# EAGLE design at91sam7x-ek (EAGLE 4.16)
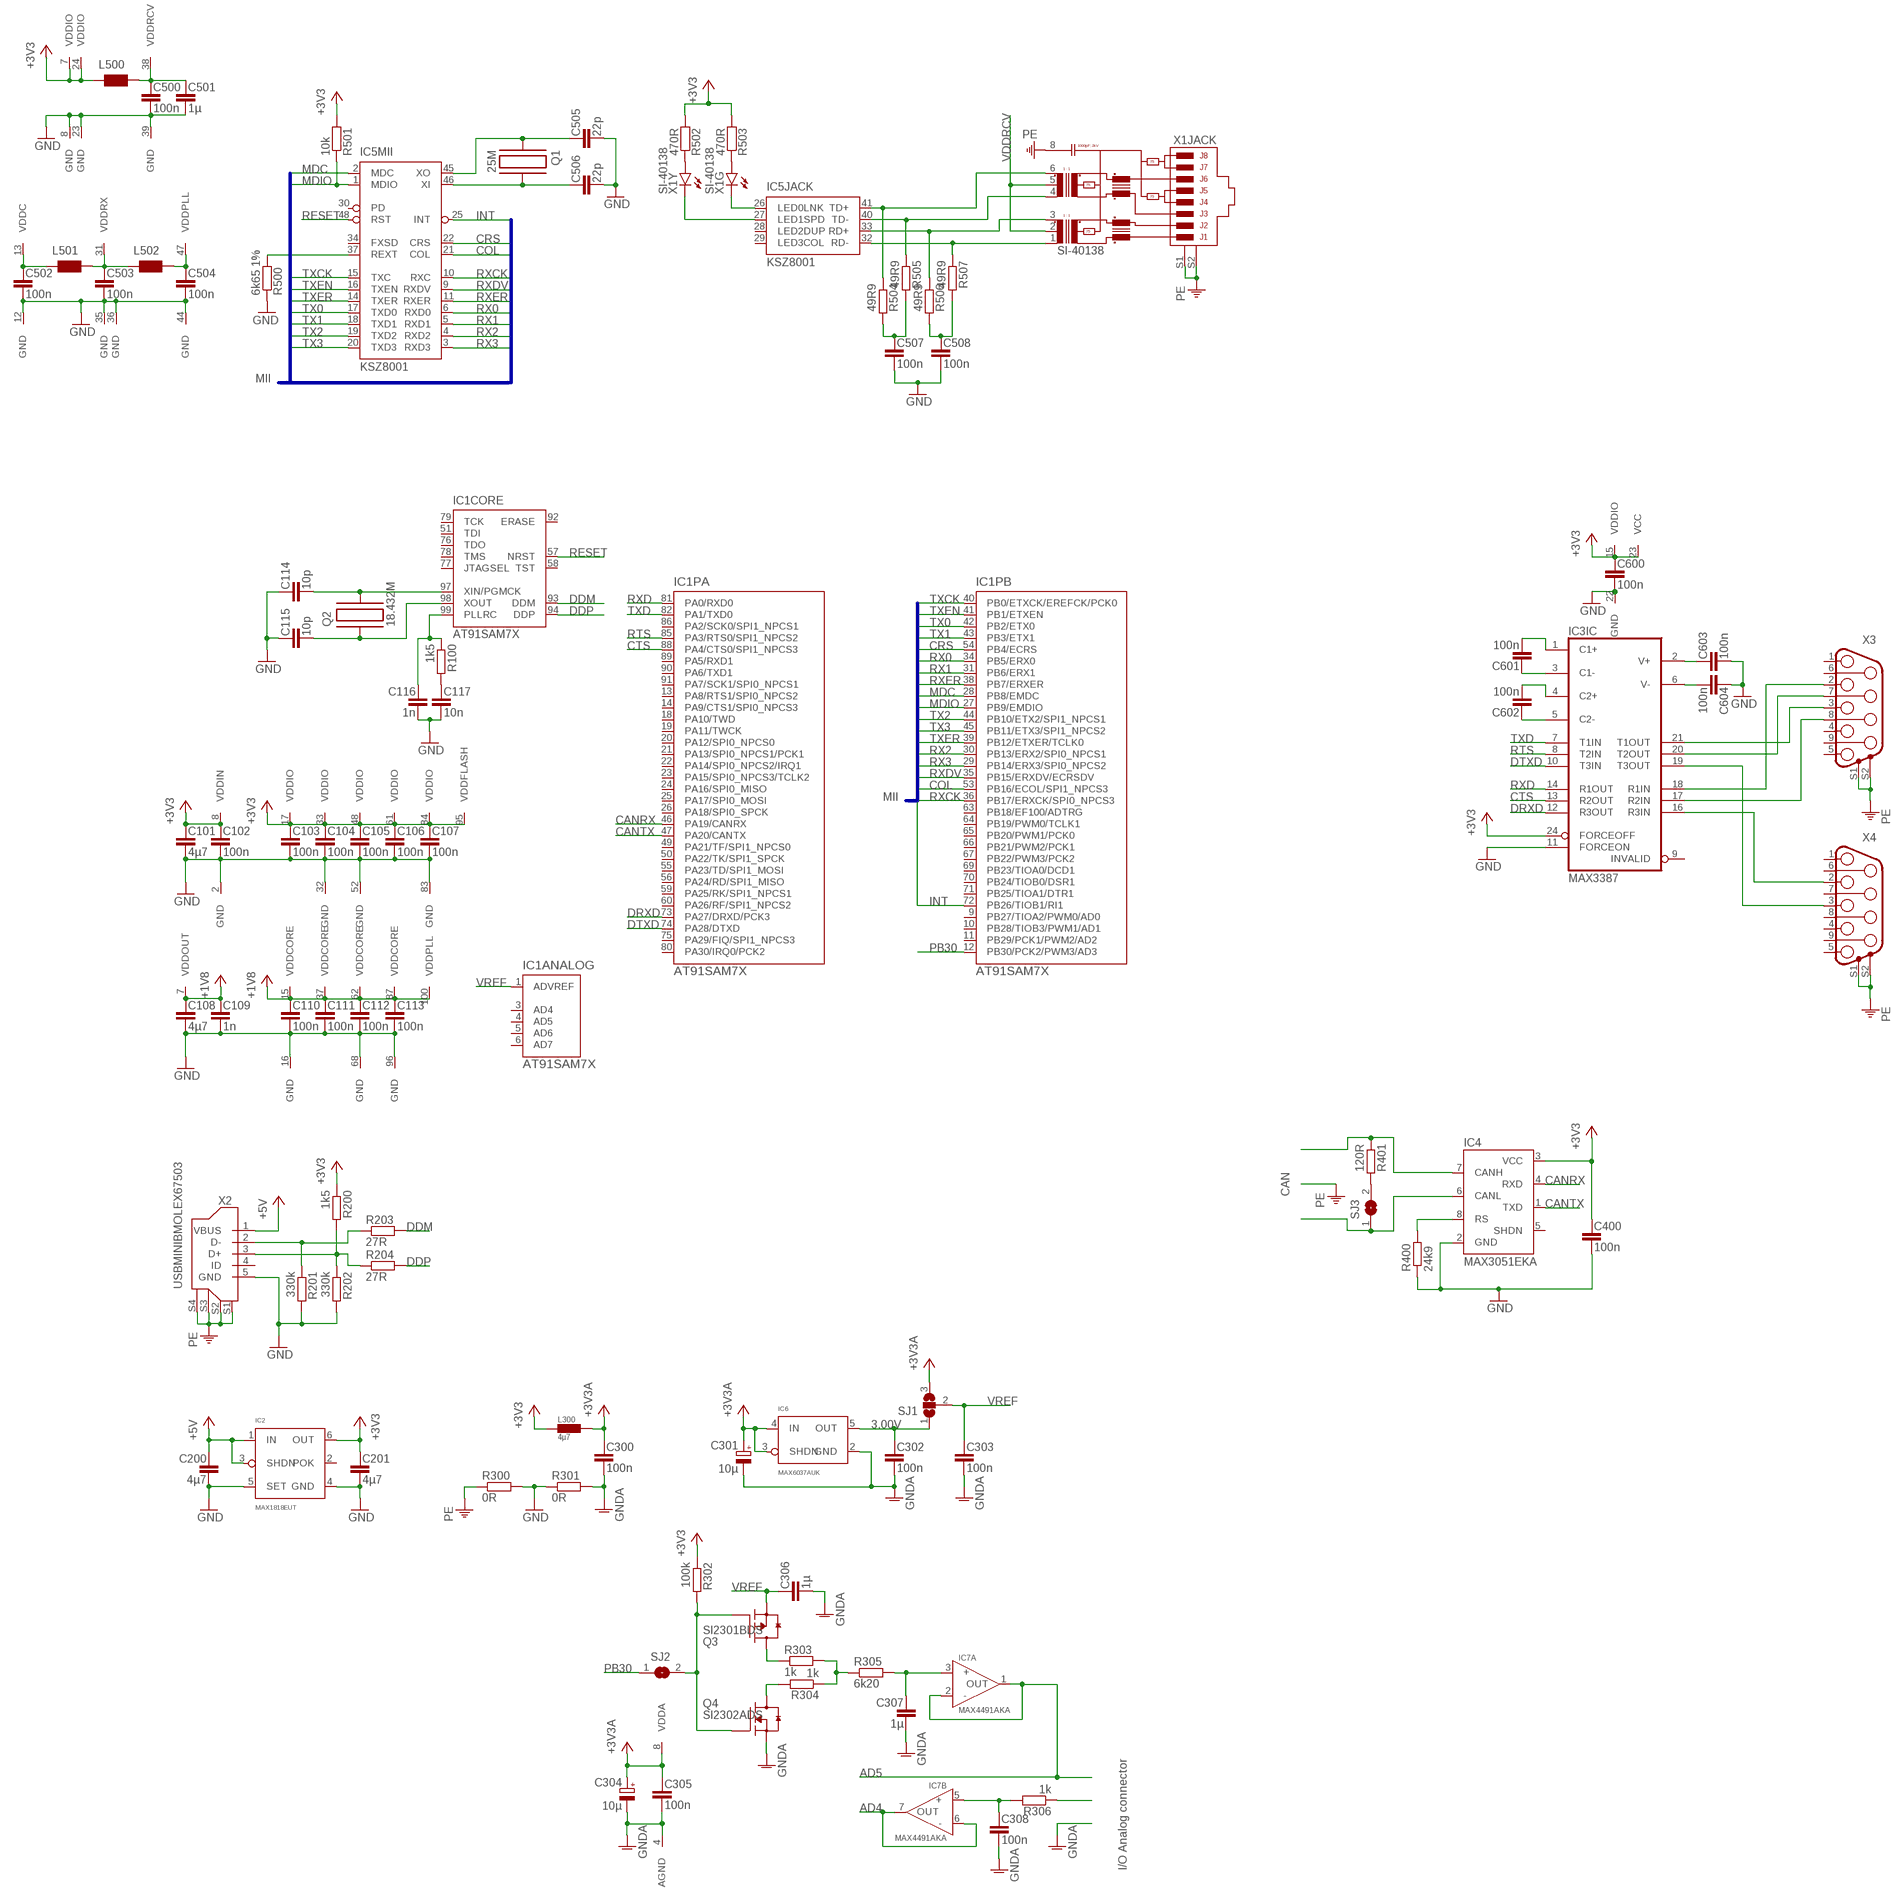
[diagram p0: schematic, sheet 1]

## Parts
C101  4µ7  C-EU  [C0603]
C102  100n  C-EU  [C0603]
C103  100n  C-EU  [C0603]
C104  100n  C-EU  [C0603]
C105  100n  C-EU  [C0603]
C106  100n  C-EU  [C0603]
C107  100n  C-EU  [C0603]
C108  4µ7  C-EU  [C0603]
C109  1n  C-EU  [C0603]
C110  100n  C-EU  [C0603]
C111  100n  C-EU  [C0603]
C112  100n  C-EU  [C0603]
C113  100n  C-EU  [C0603]
C114  10p  C-EU  [C0603]
C115  10p  C-EU  [C0603]
C116  1n  C-EU  [C0603]
C117  10n  C-EU  [C0603]
C200  4µ7  C-EU  [C0603]
C201  4µ7  C-EU  [C0603]
C300  100n  C-EU  [C0603]
C301  10µ  CPOL-EUCT3216  [CT3216]
C302  100n  C-EU  [C0603]
C303  100n  C-EU  [C0603]
C304  10µ  CPOL-EUCT3216  [CT3216]
C305  100n  C-EU  [C0603]
C306  1µ  C-EU  [C0603]
C307  1µ  C-EU  [C0603]
C308  100n  C-EU  [C0603]
C400  100n  C-EU  [C0603]
C500  100n  C-EU  [C0603]
C501  1µ  C-EU  [C0603]
C502  100n  C-EU  [C0603]
C503  100n  C-EU  [C0603]
C504  100n  C-EU  [C0603]
C505  22p  C-EU  [C0603]
C506  22p  C-EU  [C0603]
C507  100n  C-EU  [C0603]
C508  100n  C-EU  [C0603]
C600  100n  C-EU  [C0603]
C601  100n  C-EU  [C0603]
C602  100n  C-EU  [C0603]
C603  100n  C-EU  [C0603]
C604  100n  C-EU  [C0603]
IC1  AT91SAM7X  [LQFP100]
IC2  MAX1818EUT  [SOT23-6]
IC3  MAX3387  [TSSOP24]
IC4  MAX3051EKA  [SOT23-8]
IC5  KSZ8001  [LQFP48]
IC6  MAX6037AUK  [SOT23-5]
IC7  MAX4491AKA  [SOT23-8]
L300  4µ7  L-EUL0805  [L0805]
L500  WE-CBF_0603  [0603]
L501  WE-CBF_0603  [0603]
L502  WE-CBF_0603  [0603]
Q1  25M  C-MAC-LFA147E  [HC49/SMD]
Q2  18.432M  C-MAC-LFA147E  [HC49/SMD]
Q3  SI2301BDS  [SOT23]
Q4  SI2302ADS  [SOT23]
R100  1k5  R-EU  [R0603]
R200  1k5  R-EU  [R0603]
R201  330k  R-EU  [R0603]
R202  330k  R-EU  [R0603]
R203  27R  R-EU  [R0603]
R204  27R  R-EU  [R0603]
R300  0R  R-EU  [R0603]
R301  0R  R-EU  [R0603]
R302  100k  R-EU  [R0603]
R303  1k  R-EU  [R0603]
R304  1k  R-EU  [R0603]
R305  6k20  R-EU  [R0603]
R306  1k  R-EU  [R0603]
R400  24k9  R-EU  [R0603]
R401  120R  R-EU  [R0603]
R500  6k65 1%  R-EU  [R0603]
R501  10k  R-EU  [R0603]
R502  470R  R-EU  [R0603]
R503  470R  R-EU  [R0603]
R504  49R9  R-EU  [R0603]
R505  49R9  R-EU  [R0603]
R506  49R9  R-EU  [R0603]
R507  49R9  R-EU  [R0603]
SJ1  SJ_2_NO  [SJ_2_NO]
SJ2  SJ_NO  [SJ_NO]
SJ3  SJ_NO  [SJ_NO]
X1  SI-40138  [SI-40138]
X2  USBMINIBMOLEX67503  [MOLEX67503]
X3  M09HP  [M09HP]
X4  M09HP  [M09HP]

## Nets
3.00V: C302.1 IC6.5(OUT) SJ1.1
+1V8: C108.1 C109.1 C110.1 C111.1 C112.1 C113.1 IC1.7(VDDOUT) IC1.15(VDDCORE) IC1.37(VDDCORE) IC1.62(VDDCORE) IC1.87(VDDCORE) IC1.100(VDDPLL)
+3V3: C101.1 C102.1 C103.1 C104.1 C105.1 C106.1 C107.1 C201.1 C400.1 C600.1 IC1.8(VDDIN) IC1.17(VDDIO) IC1.33(VDDIO) IC1.48(VDDIO) IC1.61(VDDIO) IC1.84(VDDIO) IC1.95(VDDFLASH) IC2.6(OUT) IC3.15(VDDIO) IC3.23(VCC) IC3.24(IC:FORCEOFF) IC4.3(VCC) IC5.7(VDDIO) IC5.24(VDDIO) L300.1 L500.1 R200.1 R302.1 R501.2 R502.2 R503.2
+3V3A: C300.1 C301.+ C304.+ C305.1 IC6.3(SHDN) IC6.4(IN) IC7.8(VDDA) L300.2 SJ1.3
+5V: C200.1 IC2.1(IN) IC2.3(SHDN)
AD4: IC7.6(B:-) IC7.7(B:OUT)
AD5: IC7.1(A:OUT) IC7.2(A:-)
CANRX: IC1.46(PA:PA19/CANRX) IC4.4(RXD)
CANTX: IC1.47(PA:PA20/CANTX) IC4.1(TXD)
COL: IC1.53(PB:PB16/ECOL/SPI1_NPCS3) IC5.21(MII:COL)
CRS: IC1.54(PB:PB4/ECRS) IC5.22(MII:CRS)
CTS: IC1.88(PA:PA4/CTS0/SPI1_NPCS3) IC3.13(IC:R2OUT)
D+: R200.2 R202.1 R204.1 X2.3(D+)
D-: R201.1 R203.1 X2.2(D-)
DDM: IC1.93(CORE:DDM) R203.2
DDP: IC1.94(CORE:DDP) R204.2
DRXD: IC1.73(PA:PA27/DRXD/PCK3) IC3.12(IC:R3OUT)
DTXD: IC1.74(PA:PA28/DTXD) IC3.10(IC:T3IN)
GND: C101.2 C102.2 C103.2 C104.2 C105.2 C106.2 C107.2 C108.2 C109.2 C110.2 C111.2 C112.2 C113.2 C114.1 C115.1 C116.2 C117.2 C200.2 C201.2 C400.2 C500.2 C501.2 C502.2 C503.2 C504.2 C505.2 C506.2 C507.2 C508.2 C600.2 C603.2 C604.1 IC1.2(GND) IC1.16(GND) IC1.32(GND) IC1.52(GND) IC1.68(GND) IC1.83(GND) IC1.96(GND) IC2.4(GND) IC2.5(SET) IC3.11(IC:FORCEON) IC3.22(GND) IC4.2(GND) IC5.8(GND) IC5.12(GND) IC5.23(GND) IC5.35(GND) IC5.36(GND) IC5.39(GND) IC5.44(GND) R201.2 R202.2 R300.2 R301.1 R400.1 R500.1 X2.5(GND)
GNDA: C300.2 C301.- C302.2 C303.2 C304.- C305.2 C306.2 C307.2 C308.2 IC6.2(GND) IC7.4(AGND) Q4.2(S) R301.2
INT: IC1.72(PB:PB26/TIOB1/RI1) IC5.25(MII:INT)
L501: C502.1 IC5.13(VDDC) L501.1
MDC: IC1.28(PB:PB8/EMDC) IC5.2(MII:MDC)
MDIO: IC1.27(PB:PB9/EMDIO) IC5.1(MII:MDIO) R501.1
N$1: IC5.32(JACK:RD-) R507.1 X1.1(JACK:RD-)
N$2: IC5.33(JACK:RD+) R506.1 X1.3(JACK:RD+)
N$3: IC5.40(JACK:TD-) R505.1 X1.4(JACK:TD-)
N$4: IC5.41(JACK:TD+) R504.1 X1.6(JACK:TD+)
N$5: IC5.26(JACK:LED0LNK) X1.GC(G:C)
N$6: IC5.27(JACK:LED1SPD) X1.YC(Y:C)
N$7: R502.1 X1.YA(Y:A)
N$8: C308.1 IC7.5(B:+) R306.2
N$9: Q3.3(D) R303.1
N$10: R503.1 X1.GA(G:A)
N$11: C507.1 R504.2 R505.2
N$12: C506.1 IC5.46(MII:XI) Q1.P$2
N$13: C505.1 IC5.45(MII:XO) Q1.P$1
N$14: IC5.37(MII:REXT) R500.2
N$15: Q3.1(G) Q4.1(G) R302.2 SJ2.2
N$16: Q4.3(D) R304.2
N$17: C601.1 IC3.3(IC:C1-)
N$18: C601.2 IC3.1(IC:C1+)
N$19: C602.2 IC3.4(IC:C2+)
N$20: C602.1 IC3.5(IC:C2-)
N$21: C603.1 IC3.2(IC:V+)
N$22: C604.2 IC3.6(IC:V-)
N$23: C115.2 IC1.98(CORE:XOUT) Q2.P$1
N$24: IC4.8(RS) R400.2
N$25: C508.1 R506.2 R507.2
N$26: C114.2 IC1.97(CORE:XIN/PGMCK) Q2.P$2
N$27: C117.1 R100.2
N$28: C116.1 IC1.99(CORE:PLLRC) R100.1
N$29: R303.2 R304.1 R305.1
N$30: C307.1 IC7.3(A:+) R305.2
N$31: R306.1
N$32: IC4.6(CANL) SJ3.1
N$33: IC4.7(CANH) R401.1
N$34: R401.2 SJ3.2
N$37: IC3.18(IC:R1IN) X3.2
N$38: IC3.20(IC:T2OUT) X3.7
N$39: IC3.21(IC:T1OUT) X3.3
N$40: IC3.17(IC:R2IN) X3.8
N$41: IC3.16(IC:R3IN) X4.2
N$42: IC3.19(IC:T3OUT) X4.3
PB30: IC1.12(PB:PB30/PCK2/PWM3/AD3) SJ2.1
PE: R300.1 X1.8(JACK:GND) X1.S1(JACK:S1) X1.S2(JACK:S2) X2.S1 X2.S2 X2.S3 X2.S4 X3.S1(S2) X3.S2(S1) X4.S1(S2) X4.S2(S1)
RESET: IC1.57(CORE:NRST) IC5.48(MII:RST)
RTS: IC1.85(PA:PA3/RTS0/SPI1_NPCS2) IC3.8(IC:T2IN)
RX0: IC1.34(PB:PB5/ERX0) IC5.6(MII:RXD0)
RX1: IC1.31(PB:PB6/ERX1) IC5.5(MII:RXD1)
RX2: IC1.30(PB:PB13/ERX2/SPI0_NPCS1) IC5.4(MII:RXD2)
RX3: IC1.29(PB:PB14/ERX3/SPI0_NPCS2) IC5.3(MII:RXD3)
RXCK: IC1.36(PB:PB17/ERXCK/SPI0_NPCS3) IC5.10(MII:RXC)
RXD: IC1.81(PA:PA0/RXD0) IC3.14(IC:R1OUT)
RXDV: IC1.35(PB:PB15/ERXDV/ECRSDV) IC5.9(MII:RXDV)
RXER: IC1.38(PB:PB7/ERXER) IC5.11(MII:RXER)
TX0: IC1.42(PB:PB2/ETX0) IC5.17(MII:TXD0)
TX1: IC1.43(PB:PB3/ETX1) IC5.18(MII:TXD1)
TX2: IC1.44(PB:PB10/ETX2/SPI1_NPCS1) IC5.19(MII:TXD2)
TX3: IC1.45(PB:PB11/ETX3/SPI1_NPCS2) IC5.20(MII:TXD3)
TXCK: IC1.40(PB:PB0/ETXCK/EREFCK/PCK0) IC5.15(MII:TXC)
TXD: IC1.82(PA:PA1/TXD0) IC3.7(IC:T1IN)
TXEN: IC1.41(PB:PB1/ETXEN) IC5.16(MII:TXEN)
TXER: IC1.39(PB:PB12/ETXER/TCLK0) IC5.14(MII:TXER)
VBUS: X2.1(VBUS) ; supply symbol labelled +5V
VDDPLL: C504.1 IC5.47(VDDPLL) L502.2
VDDRCV: C500.1 C501.1 IC5.38(VDDRCV) L500.2 X1.2(JACK:CTR) X1.5(JACK:CTT)
VDDRX: C503.1 IC5.31(VDDRX) L501.2 L502.1
VREF: C303.1 C306.1 IC1.1(ANALOG:ADVREF) Q3.2(S) SJ1.2
Unconnected: IC1.3(ANALOG:AD4) IC1.4(ANALOG:AD5) IC1.5(ANALOG:AD6) IC1.6(ANALOG:AD7) IC1.9(PB:PB27/TIOA2/PWM0/AD0) IC1.10(PB:PB28/TIOB3/PWM1/AD1) IC1.11(PB:PB29/PCK1/PWM2/AD2) IC1.13(PA:PA8/RTS1/SPI0_NPCS2) IC1.14(PA:PA9/CTS1/SPI0_NPCS3) IC1.18(PA:PA10/TWD) IC1.19(PA:PA11/TWCK) IC1.20(PA:PA12/SPI0_NPCS0) IC1.21(PA:PA13/SPI0_NPCS1/PCK1) IC1.22(PA:PA14/SPI0_NPCS2/IRQ1) IC1.23(PA:PA15/SPI0_NPCS3/TCLK2) IC1.24(PA:PA16/SPI0_MISO) IC1.25(PA:PA17/SPI0_MOSI) IC1.26(PA:PA18/SPI0_SPCK) IC1.49(PA:PA21/TF/SPI1_NPCS0) IC1.50(PA:PA22/TK/SPI1_SPCK) IC1.51(CORE:TDI) IC1.55(PA:PA23/TD/SPI1_MOSI) IC1.56(PA:PA24/RD/SPI1_MISO) IC1.58(CORE:TST) IC1.59(PA:PA25/RK/SPI1_NPCS1) IC1.60(PA:PA26/RF/SPI1_NPCS2) IC1.63(PB:PB18/EF100/ADTRG) IC1.64(PB:PB19/PWM0/TCLK1) IC1.65(PB:PB20/PWM1/PCK0) IC1.66(PB:PB21/PWM2/PCK1) IC1.67(PB:PB22/PWM3/PCK2) IC1.69(PB:PB23/TIOA0/DCD1) IC1.70(PB:PB24/TIOB0/DSR1) IC1.71(PB:PB25/TIOA1/DTR1) IC1.75(PA:PA29/FIQ/SPI1_NPCS3) IC1.76(CORE:TDO) IC1.77(CORE:JTAGSEL) IC1.78(CORE:TMS) IC1.79(CORE:TCK) IC1.80(PA:PA30/IRQ0/PCK2) IC1.86(PA:PA2/SCK0/SPI1_NPCS1) IC1.89(PA:PA5/RXD1) IC1.90(PA:PA6/TXD1) IC1.91(PA:PA7/SCK1/SPI0_NPCS1) IC1.92(CORE:ERASE) IC2.2(POK) IC3.9(IC:INVALID) IC4.5(SHDN) IC5.28(JACK:LED2DUP) IC5.29(JACK:LED3COL) IC5.30(MII:PD) IC5.34(MII:FXSD) X2.4(ID) X3.1 X3.4 X3.5 X3.6 X3.9 X4.1 X4.4 X4.5 X4.6 X4.7 X4.8 X4.9

## Buses
MII:MDC,MDIO,TXCK,TXEN,TXER,TX[0..3],RXCK,RXDV,RXER,RX[0..3],CRS,COL,INT

## Notes on the sheet
- MII
- MII
- CAN
- I/O Analog connector

## Library data of the parts
C101-C117 C200 C201 C300 C302 C303 C305-C308 C400 C500-C508 C600-C604 = at91sam7x-ek:C-EU
C301 C304 = at91sam7x-ek:CPOL-EU
IC1 = at91sam7x-ek:AT91SAM7X
IC2 = at91sam7x-ek:MAX1818
IC3 = at91sam7x-ek:MAX3387
IC4 = at91sam7x-ek:MAX3051
IC5 = at91sam7x-ek:KSZ8001
IC6 = at91sam7x-ek:MAX6037
IC7 = at91sam7x-ek:MAX4491
L300 = rcl:L-EU
L500-L502 = wuerth-elektronik:WE-CBF: SMD EMI Suppression Ferrite Beads - excellent anti-EMI properties - low DCR - impedances till 3000 ohms - rated current up to 6 A
Q1 Q2 = at91sam7x-ek:C-MAC-LFA147E
Q3 = at91sam7x-ek:SI2301BDS
Q4 = at91sam7x-ek:SI2302ADS
R100 R200-R204 R300-R306 R400 R401 R500-R507 = at91sam7x-ek:R-EU
SJ1 = jumper:SJ_2_NO
SJ2 SJ3 = jumper:SJ_NO
X1 = at91sam7x-ek:SI-40138
X2 = usbminib:USBMINIB
X3 X4 = at91sam7x-ek:M09HP: SUB-D

## Board
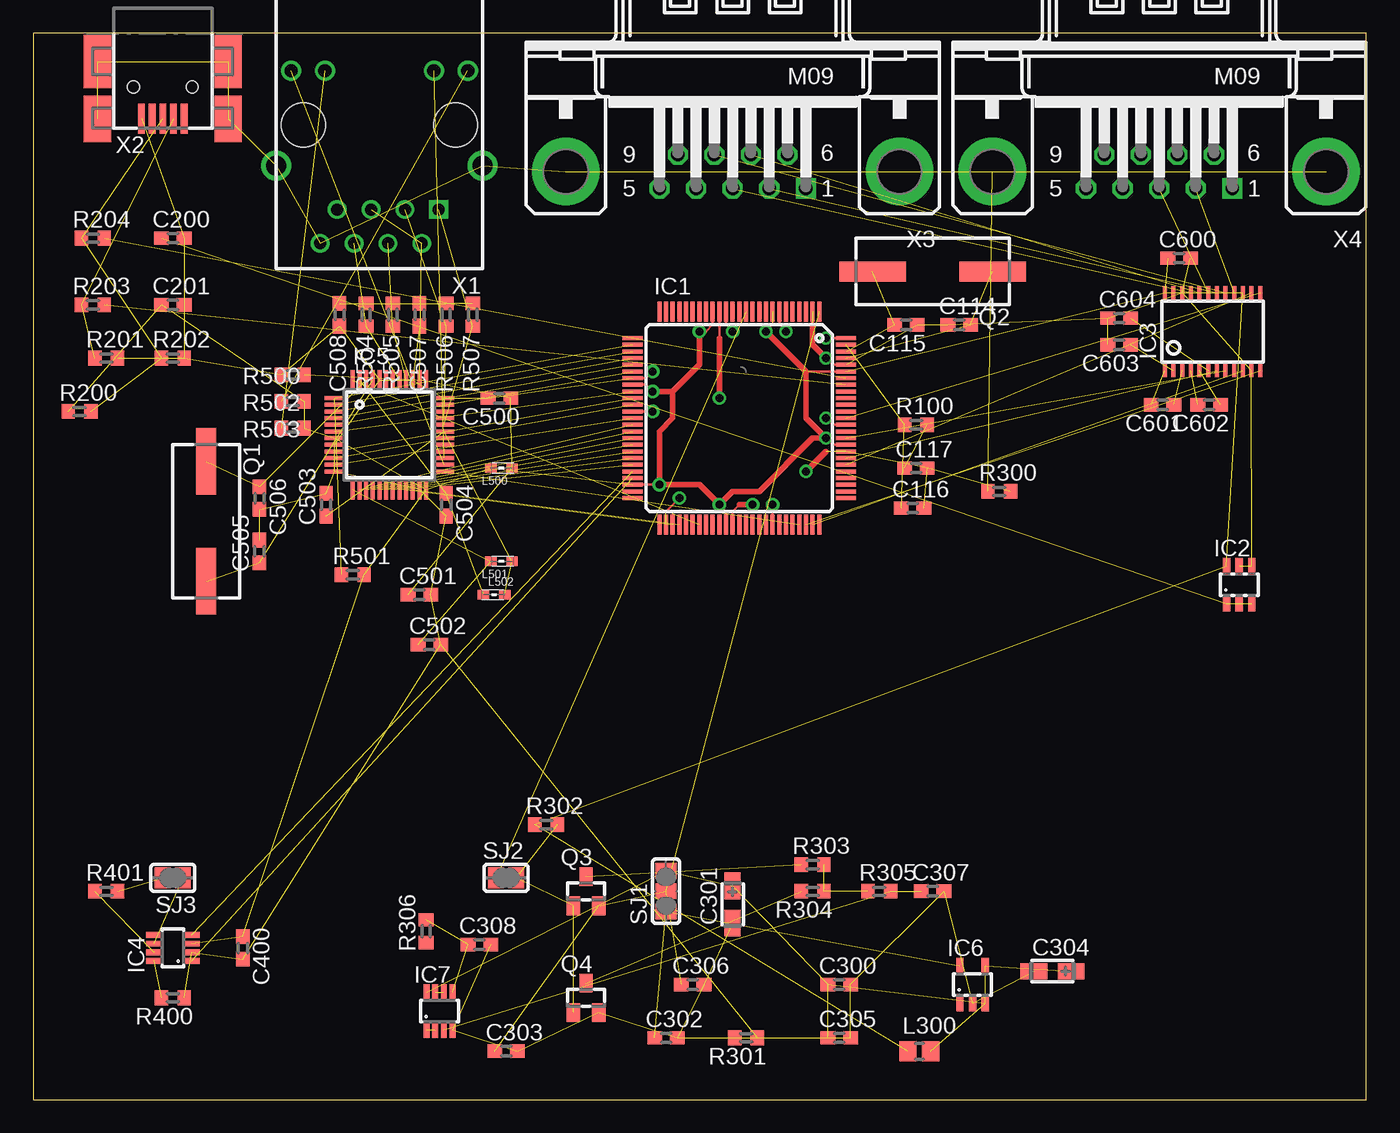
[diagram p1: board, top side]
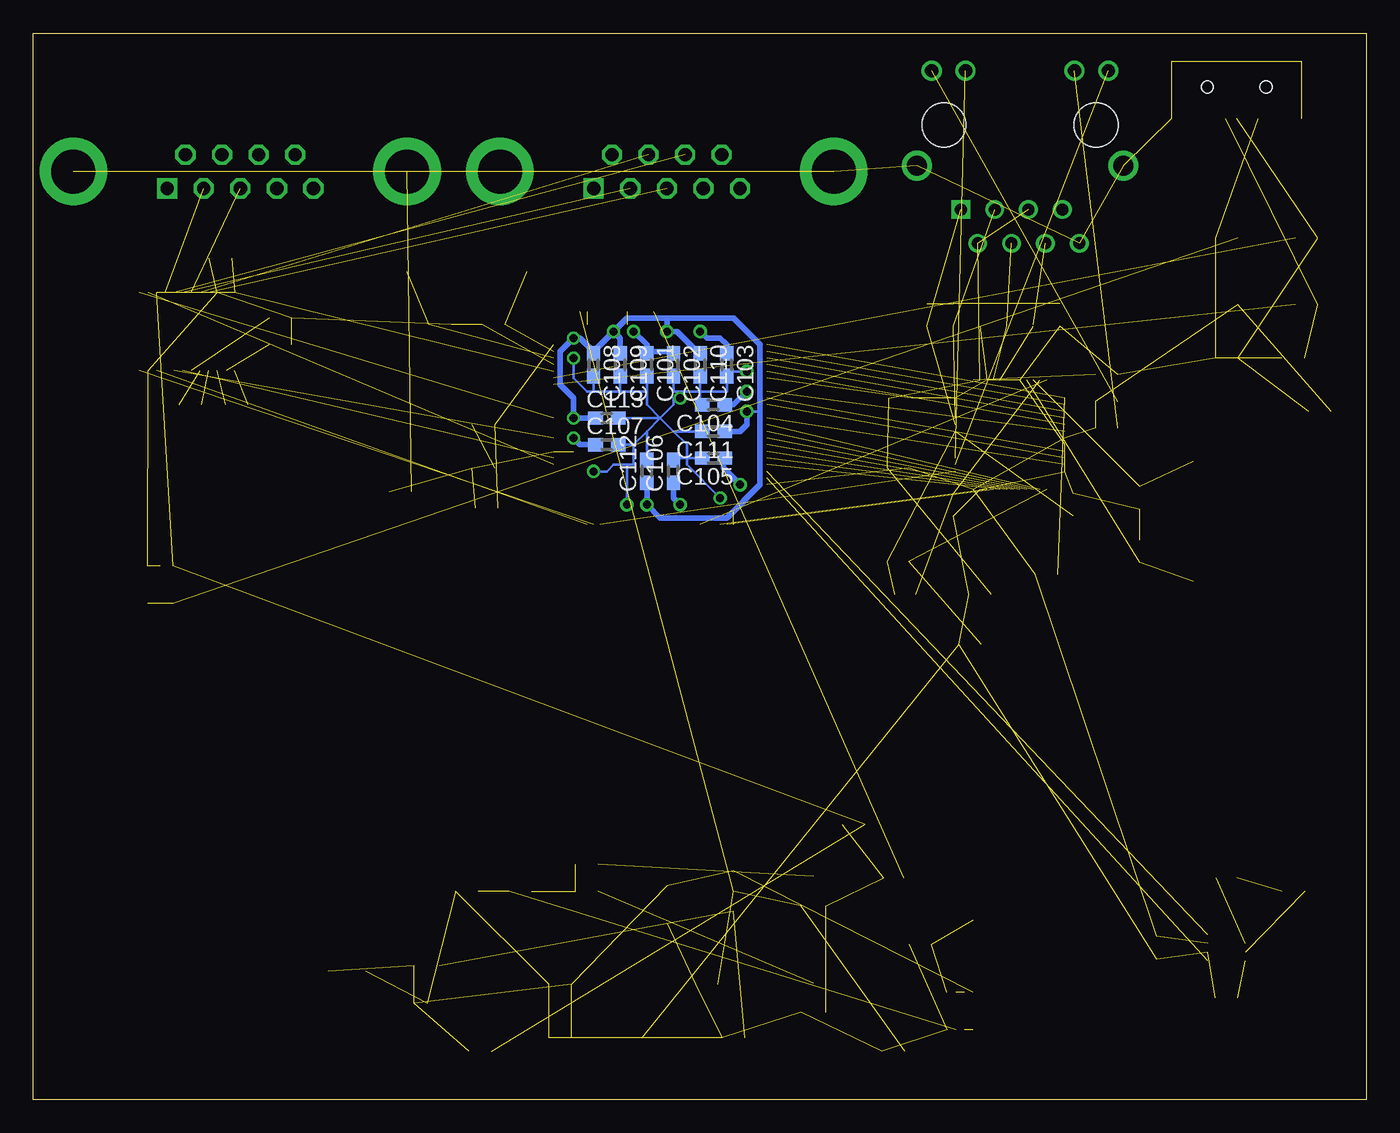
[diagram p2: board, bottom side, seen from below]

Size 100 x 80 mm. Coordinates in mm from the lower left corner, seen from the top.
Outline: 0,0 100,0 100,80 0,80 0,0
Copper layers (1*16): Top 0.035mm / dielectric 1.5mm / Bottom 0.035mm
Design rules "8mils": minimum track width 8mil, minimum drill 0.6mm, track to track 8mil, track to pad 8mil, pad to pad 8mil, via to via 8mil, smd to smd 8mil, copper to edge 10mil, drill to drill 10mil, minimum pad ring 10mil, minimum via ring 8mil, stop-mask expansion 0mil, vias tented up to drill 0mil, thermal gap 10mil

### Footprints (pad centres in the part's own frame; a part is rotated, then mirrored left to right if it is on the bottom)
C0603 = smd 1.1 x 1: 1 -0.85,0; 2 0.85,0
CT3216 = smd 2 x 1.2: + 1.4,0; - -1.4,0
LQFP100 = smd 0.297 x 1.5: 1 6,8; 2 5.5,8; 3 5,8; 4 4.5,8; 5 4,8; 6 3.5,8; 7 3,8; 8 2.5,8; 9 2,8; 10 1.5,8; 11 1,8; 12 0.5,8; 13 0,8; 14 -0.5,8; 15 -1,8; 16 -1.5,8; 17 -2,8; 18 -2.5,8; 19 -3,8; 20 -3.5,8; 21 -4,8; 22 -4.5,8; 23 -5,8; 24 -5.5,8; 25 -6,8; 51 -6,-8; 52 -5.5,-8; 53 -5,-8; 54 -4.5,-8; 55 -4,-8; 56 -3.5,-8; 57 -3,-8; 58 -2.5,-8; 59 -2,-8; 60 -1.5,-8; 61 -1,-8; 62 -0.5,-8; 63 0,-8; 64 0.5,-8; 65 1,-8; 66 1.5,-8; 67 2,-8; 68 2.5,-8; 69 3,-8; 70 3.5,-8; 71 4,-8; 72 4.5,-8; 73 5,-8; 74 5.5,-8; 75 6,-8 | smd 1.5 x 0.297: 26 -8,6; 27 -8,5.5; 28 -8,5; 29 -8,4.5; 30 -8,4; 31 -8,3.5; 32 -8,3; 33 -8,2.5; 34 -8,2; 35 -8,1.5; 36 -8,1; 37 -8,0.5; 38 -8,0; 39 -8,-0.5; 40 -8,-1; 41 -8,-1.5; 42 -8,-2; 43 -8,-2.5; 44 -8,-3; 45 -8,-3.5; 46 -8,-4; 47 -8,-4.5; 48 -8,-5; 49 -8,-5.5; 50 -8,-6; 76 8,-6; 77 8,-5.5; 78 8,-5; 79 8,-4.5; 80 8,-4; 81 8,-3.5; 82 8,-3; 83 8,-2.5; 84 8,-2; 85 8,-1.5; 86 8,-1; 87 8,-0.5; 88 8,0; 89 8,0.5; 90 8,1; 91 8,1.5; 92 8,2; 93 8,2.5; 94 8,3; 95 8,3.5; 96 8,4; 97 8,4.5; 98 8,5; 99 8,5.5; 100 8,6
SOT23-6 = smd 0.55 x 1.2: 1 -0.95,-1.4; 2 0,-1.4; 3 0.95,-1.4; 4 0.95,1.4; 5 0,1.4; 6 -0.95,1.4
TSSOP24 = smd 0.305 x 0.991: 1 -3.575,-2.918; 2 -2.925,-2.918; 3 -2.275,-2.918; 4 -1.625,-2.918; 5 -0.975,-2.918; 6 -0.325,-2.918; 7 0.325,-2.918; 8 0.975,-2.918; 9 1.625,-2.918; 10 2.275,-2.918; 11 2.925,-2.918; 12 3.575,-2.918; 13 3.575,2.918; 14 2.925,2.918; 15 2.275,2.918; 16 1.625,2.918; 17 0.975,2.918; 18 0.325,2.918; 19 -0.325,2.918; 20 -0.975,2.918; 21 -1.625,2.918; 22 -2.275,2.918; 23 -2.925,2.918; 24 -3.575,2.918
SOT23-8 = smd 0.44 x 1.2: 1 -0.975,-1.4; 2 -0.325,-1.4; 3 0.325,-1.4; 4 0.975,-1.4; 5 0.975,1.4; 6 0.325,1.4; 7 -0.325,1.4; 8 -0.975,1.4
LQFP48 = smd 1.5 x 0.297: 1 -4.1,2.75; 2 -4.1,2.25; 3 -4.1,1.75; 4 -4.1,1.25; 5 -4.1,0.75; 6 -4.1,0.25; 7 -4.1,-0.25; 8 -4.1,-0.75; 9 -4.1,-1.25; 10 -4.1,-1.75; 11 -4.1,-2.25; 12 -4.1,-2.75; 25 4.1,-2.75; 26 4.1,-2.25; 27 4.1,-1.75; 28 4.1,-1.25; 29 4.1,-0.75; 30 4.1,-0.25; 31 4.1,0.25; 32 4.1,0.75; 33 4.1,1.25; 34 4.1,1.75; 35 4.1,2.25; 36 4.1,2.75 | smd 0.297 x 1.5: 13 -2.75,-4.1; 14 -2.25,-4.1; 15 -1.75,-4.1; 16 -1.25,-4.1; 17 -0.75,-4.1; 18 -0.25,-4.1; 19 0.25,-4.1; 20 0.75,-4.1; 21 1.25,-4.1; 22 1.75,-4.1; 23 2.25,-4.1; 24 2.75,-4.1; 37 2.75,4.1; 38 2.25,4.1; 39 1.75,4.1; 40 1.25,4.1; 41 0.75,4.1; 42 0.25,4.1; 43 -0.25,4.1; 44 -0.75,4.1; 45 -1.25,4.1; 46 -1.75,4.1; 47 -2.25,4.1; 48 -2.75,4.1
SOT23-5 = smd 0.55 x 1.2: 1 -0.95,-1.4; 2 0,-1.4; 3 0.95,-1.4; 4 0.95,1.4; 5 -0.95,1.4
L0805 = smd 1.3 x 1.5: 1 -0.85,0; 2 0.85,0
0603 = smd 0.85 x 0.7: 1 -0.9,0; 2 0.7,0
HC49/SMD = smd 5 x 1.5: P$1 4.5,0; P$2 -4.5,0
SOT23 = smd 1 x 1.4: 1 -0.95,-1.1; 2 0.95,-1.1; 3 0,1.1
R0603 = smd 1 x 1.1: 1 -0.85,0; 2 0.85,0
SJ_2_NO = smd 1.168 x 1.6: 1 -1.524,0; 2 0,0; 3 1.524,0
SJ_NO = smd 1.168 x 1.6: 1 -0.762,0; 2 0.762,0
SI-40138 = drill 0.9 square: 1 -4.445,6.35 | drill 0.9 round: 2 -3.175,8.89; 3 -1.905,6.35; 4 -0.635,8.89; 5 0.635,6.35; 6 1.905,8.89; 7 3.175,6.35; 8 4.445,8.89 | drill 1 round: GA 4.089,-4.064; GC 6.629,-4.064; YA -6.629,-4.064; YC -4.089,-4.064 | drill 1.5 round: S1 -7.747,3.048; S2 7.747,3.048 | hole 3.3: -5.715,0; 5.715,0
MOLEX67503 = smd 2.25 x 0.5: 1 6.3,1.6; 2 6.3,0.8; 3 6.3,0; 4 6.3,-0.8; 5 6.3,-1.6 | smd 3.5 x 2.05: S1 6.3,4.9; S2 6.3,-4.9 | smd 4 x 2.05: S3 2,4.9; S4 2,-4.9 | hole 0.9: 3.9,2.2; 3.9,-2.2
M09HP = drill 1 square: 1 -5.486,1.27 | drill 1 octagon: 2 -2.743,1.27; 3 0,1.27; 4 2.743,1.27; 5 5.486,1.27; 6 -4.115,-1.27; 7 -1.372,-1.27; 8 1.372,-1.27; 9 4.115,-1.27 | drill 3.3 pad 5.08 round: S1 -12.522,0; S2 12.522,0

### Placement (x,y rotation side)
C101  53.97,55.13 270 bottom
C102  51.97,55.13 270 bottom
C103  47.97,55.13 270 bottom
C104  48.97,52.13 180 bottom
C105  48.97,48.13 180 bottom
C106  51.97,47.13 90 bottom
C107  56.97,49.13 0 bottom
C108  57.97,55.13 270 bottom
C109  55.97,55.13 270 bottom
C110  49.97,55.13 270 bottom
C111  48.97,50.13 180 bottom
C112  53.97,47.13 90 bottom
C113  56.97,51.13 0 bottom
C114  69.47,58.13 0 top
C115  65.47,58.13 180 top
C116  65.97,44.38 0 top
C117  66.22,47.38 0 top
C200  10.47,64.63 0 top
C201  10.47,59.63 0 top
C300  60.47,8.63 0 top
C301  52.47,14.63 90 top
C302  47.47,4.63 0 top
C303  35.47,3.63 0 top
C304  76.47,9.63 0 top
C305  60.47,4.63 0 top
C306  49.47,8.63 0 top
C307  67.47,15.63 0 top
C308  33.47,11.63 0 top
C400  15.72,11.38 270 top
C500  34.97,52.63 180 top
C501  28.97,37.88 0 top
C502  29.72,34.13 0 top
C503  21.97,44.63 90 top
C504  30.97,44.63 270 top
C505  16.97,41.13 90 top
C506  16.97,45.13 270 top
C507  28.97,58.88 270 top
C508  22.97,58.88 270 top
C600  85.97,63.13 0 top
C601  84.72,52.13 180 top
C602  88.22,52.13 180 top
C603  81.47,56.63 180 top
C604  81.47,58.63 0 top
IC1  52.97,51.13 0 top
IC2  90.47,38.63 0 top
IC3  88.47,57.63 0 top
IC4  10.47,11.38 90 top
IC5  26.72,49.88 0 top
IC6  70.47,8.63 0 top
IC7  30.47,6.63 0 top
L300  66.47,3.63 0 top
L500  35.22,47.38 0 top
L501  35.22,40.38 0 top
L502  34.47,37.88 180 top
Q1  12.97,43.38 270 top
Q2  67.47,62.13 180 top
Q3  41.47,15.63 0 top
Q4  41.47,7.63 0 top
R100  66.22,50.63 0 top
R200  3.47,51.63 0 top
R201  5.47,55.63 0 top
R202  10.47,55.63 0 top
R203  4.47,59.63 0 top
R204  4.47,64.63 0 top
R300  72.47,45.63 0 top
R301  53.47,4.63 180 top
R302  38.47,20.63 0 top
R303  58.47,17.63 0 top
R304  58.47,15.63 180 top
R305  63.47,15.63 0 top
R306  29.47,12.63 90 top
R400  10.47,7.63 180 top
R401  5.47,15.63 0 top
R500  19.47,54.38 0 top
R501  23.97,39.38 0 top
R502  19.47,52.38 0 top
R503  19.47,50.38 0 top
R504  24.97,58.88 90 top
R505  26.97,58.88 90 top
R506  30.97,58.88 90 top
R507  32.97,58.88 90 top
SJ1  47.47,15.63 90 top
SJ2  35.47,16.63 0 top
SJ3  10.47,16.63 180 top
X1  25.97,73.13 180 top
X2  9.72,79.88 270 top
X3  52.47,69.63 180 top
X4  84.47,69.63 180 top

### Tracks (layer width: path | path; a pad name or v marks a point on that pad's centre or on a via)
3.00V  (2 unrouted)
+1V8  (via drill 0.6)
  Top 0.203: 52.97,44.63 52.47,44.13 IC1.62 | v46.47,51.63 IC1.37 | IC1.7 55.97,58.13 v56.47,57.63 | v52.47,57.63 51.97,58.13 IC1.15 | v59.47,51.13 59.97,50.63 IC1.87 | v59.47,57.13 IC1.100
  Top 0.406: v53.97,44.63 52.97,44.63
  Bottom 0.203: 57.97,56.13 C108.1 | 58.97,57.13 v59.47,57.13 | v46.47,51.63 | 45.47,51.63 v46.47,51.63
  Bottom 0.406: C112.1 v53.97,44.63 52.97,43.63 47.97,43.63 45.47,46.13 45.47,51.63 45.47,56.63 47.47,58.63 52.47,58.63 | C111.1 46.97,50.13 46.47,50.63 v46.47,51.63 | v56.47,57.63 55.97,57.13 C109.1 | v56.47,57.63 57.97,56.13 58.97,57.13 | C113.1 v59.47,51.13 59.47,52.63 60.47,53.63 60.47,56.13 v59.47,57.13 | 52.47,58.63 55.47,58.63 v56.47,57.63 | 52.47,58.63 v52.47,57.63 51.72,57.63 49.97,55.88 C110.1
+3V3  (via drill 0.6)  (18 unrouted)
  Top 0.203: v51.47,44.63 51.97,44.13 IC1.61 | IC1.48 v46.97,46.13 | IC1.33 45.97,53.63 v46.47,53.13 | v54.97,57.63 55.47,58.13 | IC1.17 50.97,58.13 50.47,57.63 v49.97,57.63 | v59.47,49.63 59.97,49.13 IC1.84 | 57.97,54.63 IC1.95
  Top 0.406: v54.97,57.63 57.97,54.63 57.97,51.13 v59.47,49.63 58.47,49.63 54.47,45.63 52.47,45.63 v51.47,44.63 49.97,46.13 v46.97,46.13 46.97,50.13 47.97,51.13 47.97,53.13 | 47.97,53.13 v46.47,53.13 | v49.97,57.63 49.97,55.13 47.97,53.13
  Bottom 0.203: 47.47,52.13 C104.1 | C101.1 53.97,56.13 53.97,56.63 | 47.97,56.63 C103.1 | 51.97,56.13 C102.1
  Bottom 0.406: C106.1 51.97,45.13 v51.47,44.63 | v46.47,53.13 47.47,52.13 | v54.97,57.63 53.97,56.63 | 47.97,56.63 48.47,57.13 49.47,57.13 v49.97,57.63 | C107.1 58.97,49.13 v59.47,49.63 | v46.97,46.13 48.22,47.38 48.22,48.13 C105.1 | 53.97,56.13 51.97,56.13
+3V3A  (8 unrouted)
+5V  (2 unrouted)
AD4  (1 unrouted)
AD5  (1 unrouted)
CANRX  (1 unrouted)
CANTX  (1 unrouted)
COL  (1 unrouted)
CRS  (1 unrouted)
CTS  (1 unrouted)
D+  (3 unrouted)
D-  (2 unrouted)
DDM  (1 unrouted)
DDP  (1 unrouted)
DRXD  (1 unrouted)
DTXD  (1 unrouted)
GND  (via drill 0.6)  (41 unrouted)
  Top 0.203: v46.47,54.63 45.97,54.13 IC1.32 | v48.47,45.13 47.47,44.13 | v55.47,44.63 IC1.68 | IC1.96 59.97,55.13 v59.47,55.63 | 51.47,57.13 IC1.16
  Top 0.406: v57.97,47.13 59.47,48.63 | 58.47,58.13 58.47,56.63 v59.47,55.63 | v51.47,52.63 51.47,57.13
  Bottom 0.203: 47.97,54.38 47.97,54.63 v46.47,54.63 | 51.97,50.13 C111.2 | 49.97,53.13 47.97,53.13 47.97,54.38 | 52.97,51.13 51.97,52.13 51.97,52.63 v51.47,52.63 51.47,53.13 | 53.97,53.13 53.97,52.13 52.97,51.13 | 52.97,51.13 C113.2 | 53.97,50.13 54.97,49.13 | 53.97,50.13 C112.2 | 52.97,51.13 53.97,50.13 | 50.97,48.13 50.97,49.13 51.97,50.13 | 51.97,50.13 52.97,51.13 | v48.47,45.13 50.97,47.63 50.97,48.13 | v57.97,47.13 56.97,47.13 56.47,47.63 55.47,47.63 | v59.47,55.63 59.47,54.13 58.47,53.13 57.97,53.13 | 51.47,53.13 49.97,53.13 | 49.97,53.13 C110.2 | 55.47,47.63 v55.47,44.63 | 55.47,47.63 54.97,47.63 54.97,49.13 | 57.97,53.13 C108.2 | 53.97,53.13 55.97,53.13 | 55.97,53.13 57.97,53.13 | 55.97,54.38 C109.2 55.97,53.13 | 47.97,54.38 C103.2 | C104.2 49.97,52.13 49.97,53.13 | 51.97,54.38 C102.2 51.97,53.13 51.47,53.13 | 53.97,54.38 C101.2 53.97,53.13 | 56.22,49.13 C107.2 54.97,49.13 | C106.2 51.97,48.13 50.97,48.13 | 50.97,48.13 C105.2
GNDA  (12 unrouted)
INT  (1 unrouted)
L501  (2 unrouted)
MDC  (1 unrouted)
MDIO  (2 unrouted)
N$1  (2 unrouted)
N$2  (2 unrouted)
N$3  (2 unrouted)
N$4  (2 unrouted)
  Top 0.3: R504.1 24.97,58.13
N$5  (1 unrouted)
N$6  (1 unrouted)
N$7  (1 unrouted)
N$8  (2 unrouted)
N$9  (1 unrouted)
N$10  (1 unrouted)
N$11  (2 unrouted)
N$12  (2 unrouted)
N$13  (2 unrouted)
N$14  (1 unrouted)
N$15  (3 unrouted)
N$16  (1 unrouted)
N$17  (1 unrouted)
N$18  (1 unrouted)
N$19  (1 unrouted)
N$20  (1 unrouted)
N$21  (1 unrouted)
N$22  (1 unrouted)
N$23  (2 unrouted)
N$24  (1 unrouted)
N$25  (2 unrouted)
N$26  (2 unrouted)
N$27  (1 unrouted)
N$28  (2 unrouted)
N$29  (2 unrouted)
N$30  (2 unrouted)
N$32  (1 unrouted)
N$33  (1 unrouted)
N$34  (1 unrouted)
N$37  (1 unrouted)
N$38  (1 unrouted)
N$39  (1 unrouted)
N$40  (1 unrouted)
N$41  (1 unrouted)
N$42  (1 unrouted)
PB30  (1 unrouted)
PE  (11 unrouted)
RESET  (1 unrouted)
RTS  (1 unrouted)
RX0  (1 unrouted)
RX1  (1 unrouted)
RX2  (1 unrouted)
RX3  (1 unrouted)
RXCK  (1 unrouted)
RXD  (1 unrouted)
RXDV  (1 unrouted)
RXER  (1 unrouted)
TX0  (1 unrouted)
TX1  (1 unrouted)
TX2  (1 unrouted)
TX3  (1 unrouted)
TXCK  (1 unrouted)
TXD  (1 unrouted)
TXEN  (1 unrouted)
TXER  (1 unrouted)
VDDPLL  (2 unrouted)
VDDRCV  (5 unrouted)
VDDRX  (3 unrouted)
VREF  (4 unrouted)